# Altium schematic sheet ADC.SchDoc
size 420 x 297 mm; SheetNumber: 19; SheetTotal: 21
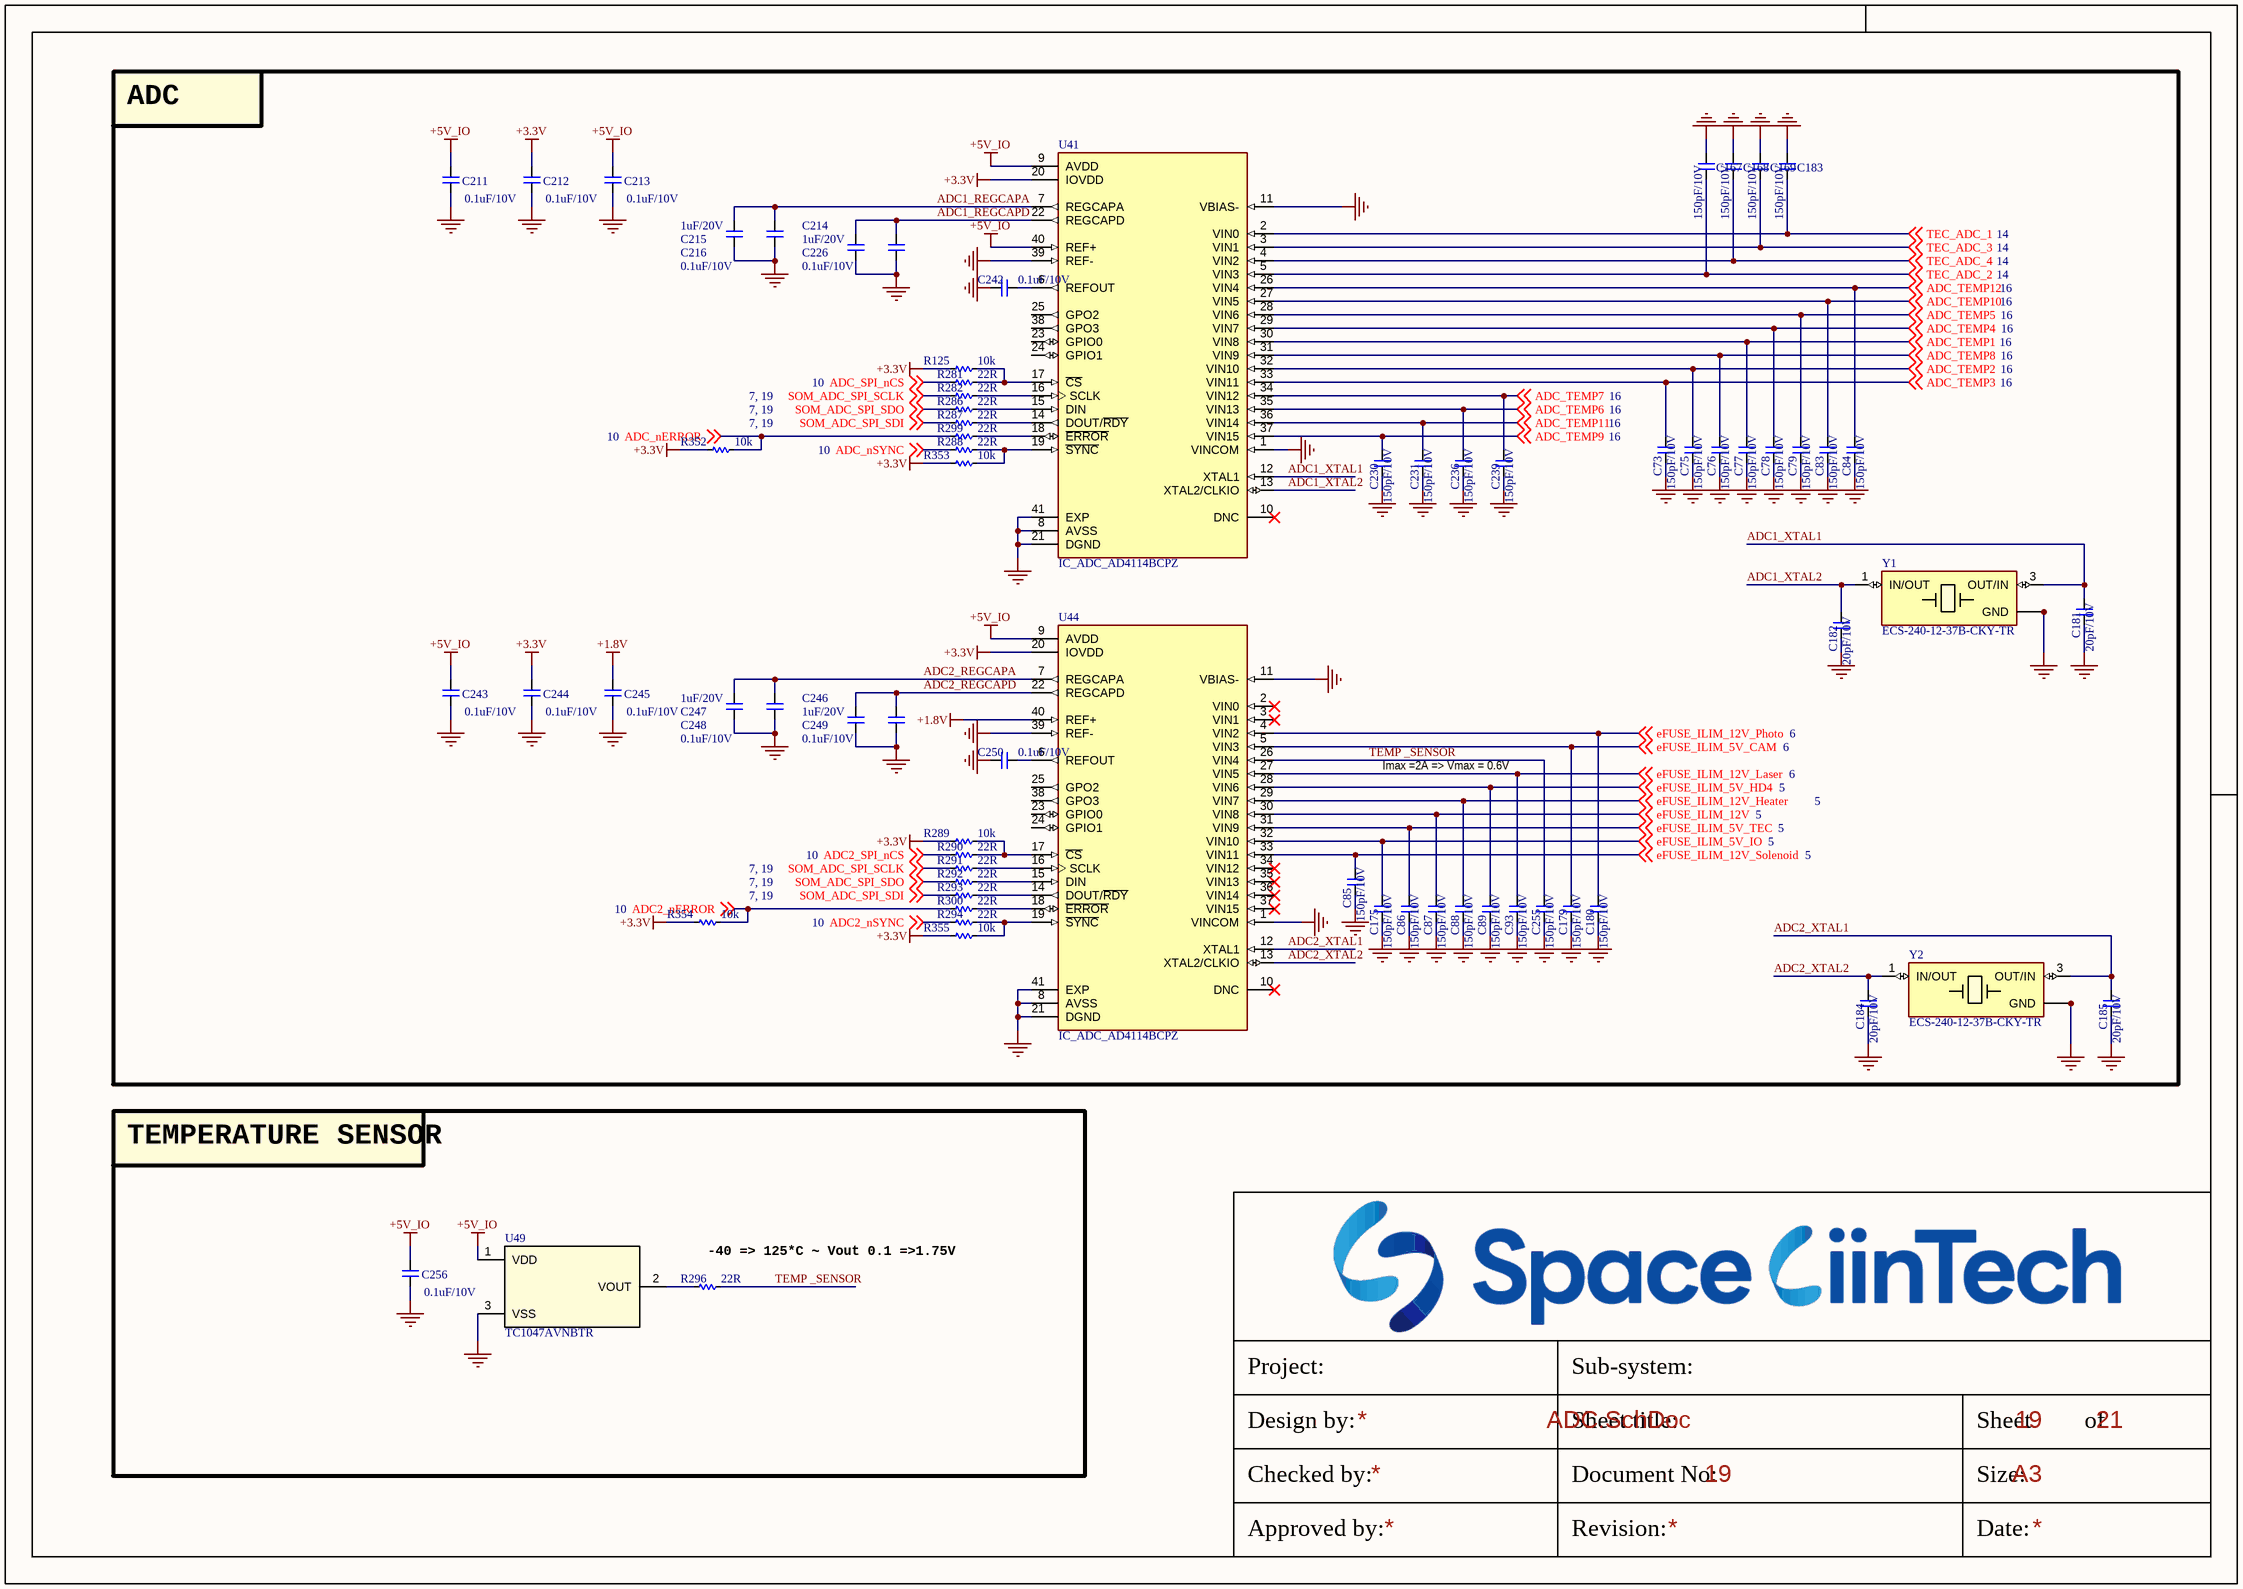
[diagram p0: ADC.SchDoc]

## Parts
C73  150pF/10V  [CAP_C_1005X60]
C75  150pF/10V  [CAP_C_1005X60]
C76  150pF/10V  [CAP_C_1005X60]
C77  150pF/10V  [CAP_C_1005X60]
C78  150pF/10V  [CAP_C_1005X60]
C79  150pF/10V  [CAP_C_1005X60]
C83  150pF/10V  [CAP_C_1005X60]
C84  150pF/10V  [CAP_C_1005X60]
C85  150pF/10V  [CAP_C_1005X60]
C86  150pF/10V  [CAP_C_1005X60]
C87  150pF/10V  [CAP_C_1005X60]
C88  150pF/10V  [CAP_C_1005X60]
C89  150pF/10V  [CAP_C_1005X60]
C93  150pF/10V  [CAP_C_1005X60]
C167  150pF/10V  [CAP_C_1005X60]
C168  150pF/10V  [CAP_C_1005X60]
C169  150pF/10V  [CAP_C_1005X60]
C175  150pF/10V  [CAP_C_1005X60]
C179  150pF/10V  [CAP_C_1005X60]
C180  150pF/10V  [CAP_C_1005X60]
C181  20pF/10V  [CAP_C_1005X60]
C182  20pF/10V  [CAP_C_1005X60]
C183  150pF/10V  [CAP_C_1005X60]
C184  20pF/10V  [CAP_C_1005X60]
C185  20pF/10V  [CAP_C_1005X60]
C211  0.1uF/10V  [CAP_C_1005X60]
C212  0.1uF/10V  [CAP_C_1005X60]
C213  0.1uF/10V  [CAP_C_1005X60]
C214  1uF/20V  [CAP_C_1005X60]
C215  1uF/20V  [CAP_C_1005X60]
C216  0.1uF/10V  [CAP_C_1005X60]
C226  0.1uF/10V  [CAP_C_1005X60]
C230  150pF/10V  [CAP_C_1005X60]
C231  150pF/10V  [CAP_C_1005X60]
C236  150pF/10V  [CAP_C_1005X60]
C239  150pF/10V  [CAP_C_1005X60]
C242  0.1uF/10V  [CAP_C_1005X60]
C243  0.1uF/10V  [CAP_C_1005X60]
C244  0.1uF/10V  [CAP_C_1005X60]
C245  0.1uF/10V  [CAP_C_1005X60]
C246  1uF/20V  [CAP_C_1005X60]
C247  1uF/20V  [CAP_C_1005X60]
C248  0.1uF/10V  [CAP_C_1005X60]
C249  0.1uF/10V  [CAP_C_1005X60]
C250  0.1uF/10V  [CAP_C_1005X60]
C255  150pF/10V  [CAP_C_1005X60]
C256  0.1uF/10V  [CAP_C_1005X60]
R125  10k  [RES_C_1005X40]
R281  22R  [RES_C_1005X40]
R282  22R  [RES_C_1005X40]
R286  22R  [RES_C_1005X40]
R287  22R  [RES_C_1005X40]
R288  22R  [RES_C_1005X40]
R289  10k  [RES_C_1005X40]
R290  22R  [RES_C_1005X40]
R291  22R  [RES_C_1005X40]
R292  22R  [RES_C_1005X40]
R293  22R  [RES_C_1005X40]
R294  22R  [RES_C_1005X40]
R296  22R  [RES_C_1005X40]
R299  22R  [RES_C_1005X40]
R300  22R  [RES_C_1005X40]
R352  10k  [RES_C_1005X40]
R353  10k  [RES_C_1005X40]
R354  10k  [RES_C_1005X40]
R355  10k  [RES_C_1005X40]
U41  IC_ADC_AD4114BCPZ  [QFN50P600X600X100-41N]
U44  IC_ADC_AD4114BCPZ  [QFN50P600X600X100-41N]
U49  TC1047AVNBTR  [SOT95P240X120-3N]
Y1  ECS-240-12-37B-CKY-TR  [XTAL_ECS-240-12-37B-CKY-TR]
Y2  ECS-240-12-37B-CKY-TR  [XTAL_ECS-240-12-37B-CKY-TR]

## Blocks framed on the sheet
ADC: C73 C75-C79 C83-C89 C93 C167-C169 C175 C179-C185 C211-C216 C226 C230 C231 C236 C239 C242-C250 C255 R125 R281 R282 R286-R294 R299 R300 R352-R355 U41 U44 Y1 Y2
TEMPERATURE SENSOR: C256 R296 U49

## Nets
+1.8V: C245.2 U44.40(REF+)
+3.3V: C212.2 C244.2 R125.2 R289.2 R352.2 R353.2 R354.2 R355.2 U41.20(IOVDD) U44.20(IOVDD)
+5V_IO: C211.2 C213.2 C243.2 C256.2 U41.9(AVDD) U41.40(REF+) U44.9(AVDD) U49.1(VDD)
GND: C73.1 C75.1 C76.1 C77.1 C78.1 C79.1 C83.1 C84.1 C85.1 C86.1 C87.1 C88.1 C89.1 C93.1 C167.1 C168.1 C169.1 C175.1 C179.1 C180.1 C181.1 C182.1 C183.1 C184.1 C185.1 C211.1 C212.1 C213.1 C214.1 C215.1 C216.1 C226.1 C230.1 C231.1 C236.1 C239.1 C242.1 C243.1 C244.1 C245.1 C246.1 C247.1 C248.1 C249.1 C250.1 C255.1 C256.1 U41.1(VINCOM) U41.8(AVSS) U41.11(VBIAS-) U41.21(DGND) U41.39(REF-) U41.41(EXP) U44.1(VINCOM) U44.8(AVSS) U44.11(VBIAS-) U44.21(DGND) U44.39(REF-) U44.41(EXP) U49.3(VSS) Y1.2(GND) Y1.4(GND) Y2.2(GND) Y2.4(GND)
ADC1_REGCAPA: C215.2 C216.2 U41.7(REGCAPA)
ADC1_REGCAPD: C214.2 C226.2 U41.22(REGCAPD)
ADC1_XTAL1: C181.2 U41.12(XTAL1) Y1.3(OUT/IN)
ADC1_XTAL2: C182.2 U41.13(XTAL2/CLKIO) Y1.1(IN/OUT)
ADC2_nERROR: R300.1 R354.1 ; off-sheet ADC2_nERROR
ADC2_nSYNC: R294.1 ; off-sheet ADC2_nSYNC
ADC2_REGCAPA: C247.2 C248.2 U44.7(REGCAPA)
ADC2_REGCAPD: C246.2 C249.2 U44.22(REGCAPD)
ADC2_SPI_nCS: R290.1 ; off-sheet ADC2_SPI_nCS
ADC2_XTAL1: C185.2 U44.12(XTAL1) Y2.3(OUT/IN)
ADC2_XTAL2: C184.2 U44.13(XTAL2/CLKIO) Y2.1(IN/OUT)
ADC_nERROR: R299.1 R352.1 ; off-sheet ADC_nERROR
ADC_nSYNC: R288.1 ; off-sheet ADC_nSYNC
ADC_SPI_nCS: R281.1 ; off-sheet ADC_SPI_nCS
ADC_TEMP1: C77.2 U41.30(VIN8) ; off-sheet ADC_TEMP1
ADC_TEMP2: C75.2 U41.32(VIN10) ; off-sheet ADC_TEMP2
ADC_TEMP3: C73.2 U41.33(VIN11) ; off-sheet ADC_TEMP3
ADC_TEMP4: C78.2 U41.29(VIN7) ; off-sheet ADC_TEMP4
ADC_TEMP5: C79.2 U41.28(VIN6) ; off-sheet ADC_TEMP5
ADC_TEMP6: C236.2 U41.35(VIN13) ; off-sheet ADC_TEMP6
ADC_TEMP7: C239.2 U41.34(VIN12) ; off-sheet ADC_TEMP7
ADC_TEMP8: C76.2 U41.31(VIN9) ; off-sheet ADC_TEMP8
ADC_TEMP9: C230.2 U41.37(VIN15) ; off-sheet ADC_TEMP9
ADC_TEMP10: C83.2 U41.27(VIN5) ; off-sheet ADC_TEMP10
ADC_TEMP11: C231.2 U41.36(VIN14) ; off-sheet ADC_TEMP11
ADC_TEMP12: C84.2 U41.26(VIN4) ; off-sheet ADC_TEMP12
eFUSE_ILIM_5V_CAM: C179.2 U44.5(VIN3) ; off-sheet eFUSE_ILIM_5V_CAM
eFUSE_ILIM_5V_HD4: C89.2 U44.28(VIN6) ; off-sheet eFUSE_ILIM_5V_HD4
eFUSE_ILIM_5V_IO: C175.2 U44.32(VIN10) ; off-sheet eFUSE_ILIM_5V_IO
eFUSE_ILIM_5V_TEC: C86.2 U44.31(VIN9) ; off-sheet eFUSE_ILIM_5V_TEC
eFUSE_ILIM_12V: C87.2 U44.30(VIN8) ; off-sheet eFUSE_ILIM_12V
eFUSE_ILIM_12V_Heater: C88.2 U44.29(VIN7) ; off-sheet eFUSE_ILIM_12V_Heater
eFUSE_ILIM_12V_Laser: C93.2 U44.27(VIN5) ; off-sheet eFUSE_ILIM_12V_Laser
eFUSE_ILIM_12V_Photo: C180.2 U44.4(VIN2) ; off-sheet eFUSE_ILIM_12V_Photo
eFUSE_ILIM_12V_Solenoid: C85.2 U44.33(VIN11) ; off-sheet eFUSE_ILIM_12V_Solenoid
SOM_ADC_SPI_SCLK: R282.1 R291.1 ; off-sheet SOM_ADC_SPI_SCLK
SOM_ADC_SPI_SDI: R287.1 R293.1 ; off-sheet SOM_ADC_SPI_SDI
SOM_ADC_SPI_SDO: R286.1 R292.1 ; off-sheet SOM_ADC_SPI_SDO
TEC_ADC_1: C183.2 U41.2(VIN0) ; off-sheet TEC_ADC_1
TEC_ADC_2: C167.2 U41.5(VIN3) ; off-sheet TEC_ADC_2
TEC_ADC_3: C169.2 U41.3(VIN1) ; off-sheet TEC_ADC_3
TEC_ADC_4: C168.2 U41.4(VIN2) ; off-sheet TEC_ADC_4
TEMP _SENSOR: C255.2 R296.2 U44.26(VIN4)
NetC242_2: C242.2 U41.6(REFOUT)
NetC250_2: C250.2 U44.6(REFOUT)
NetR125_1: R125.1 R281.2 U41.17(~{CS})
NetR282_2: R282.2 U41.16(SCLK)
NetR286_2: R286.2 U41.15(DIN)
NetR287_2: R287.2 U41.14(DOUT/~{RDY})
NetR288_2: R288.2 R353.1 U41.19(~{SYNC})
NetR289_1: R289.1 R290.2 U44.17(~{CS})
NetR291_2: R291.2 U44.16(SCLK)
NetR292_2: R292.2 U44.15(DIN)
NetR293_2: R293.2 U44.14(DOUT/~{RDY})
NetR294_2: R294.2 R355.1 U44.19(~{SYNC})
NetR296_1: R296.1 U49.2(VOUT)
NetR299_2: R299.2 U41.18(~{ERROR})
NetR300_2: R300.2 U44.18(~{ERROR})

Not connected (* = marked no-connect by the designer): U41 10(DNC)* 23(GPIO0) 24(GPIO1) 25(GPO2) 38(GPO3); U44 2(VIN0)* 3(VIN1)* 10(DNC)* 23(GPIO0) 24(GPIO1) 25(GPO2) 34(VIN12)* 35(VIN13)* 36(VIN14)* 37(VIN15)* 38(GPO3)

## Notes on the sheet
- Imax =2A => Vmax = 0.6V
- (near R296) -40 => 125*C ~ Vout 0.1 =>1.75V
- Project:
- Sub-system:
- Design by:
- Sheet title:
- Sheet
- of
- Checked by:
- Approved by:
- Revision:
- Document No:
- Size:
- Date:
- A3

## Library data of the parts
C73 C75-C79 C83-C89 C93 C167-C169 C175 C179-C185 C211-C216 C226 C230 C231 C236 C239 C242-C250 C255 C256 = _CAP_C_2: CAP CHIP
R125 R281 R282 R286-R294 R296 R299 R300 R352-R355 = _RES_B_2: RES
U41 U44 = IC_ADC_AD4114BCPZ: Single Supply, Multichannel, 31.25 kSPS, 24-Bit, Sigma-Delta ADC with Â±10 V Inputs; MF: Analog Devices; Value: *; SnapEDA_Link: https://www.snapeda.com/parts/AD4114BCPZ/Analog+Devices/view-part/?ref=snap; MP: AD4114BCPZ; Purchase-URL: https://pricing.snapeda.com/search/part/AD4114BCPZ/?ref=eda; Check_prices: https://www.snapeda.com/parts/AD4114BCPZ/Analog+Devices/view-part/?ref=eda; Availability: In Stock; Price: None; Package: VFQFN-40 Analog Devices
U49 = IC_SENSOR_TC1047AVNBTR: Temperature Sensor Analog, Local -40°C ~ 125°C 10mV/°C SOT-23-3
Y1 Y2 = ECS-240-12-37B-CKY-TR: Package: None; Price: None; Value: *; MP: ECS-240-12-37B-CKY-TR; Availability: Unavailable